# Altium project Bluetooth_Controlled_Led_Matrix_Design.PrjPcb
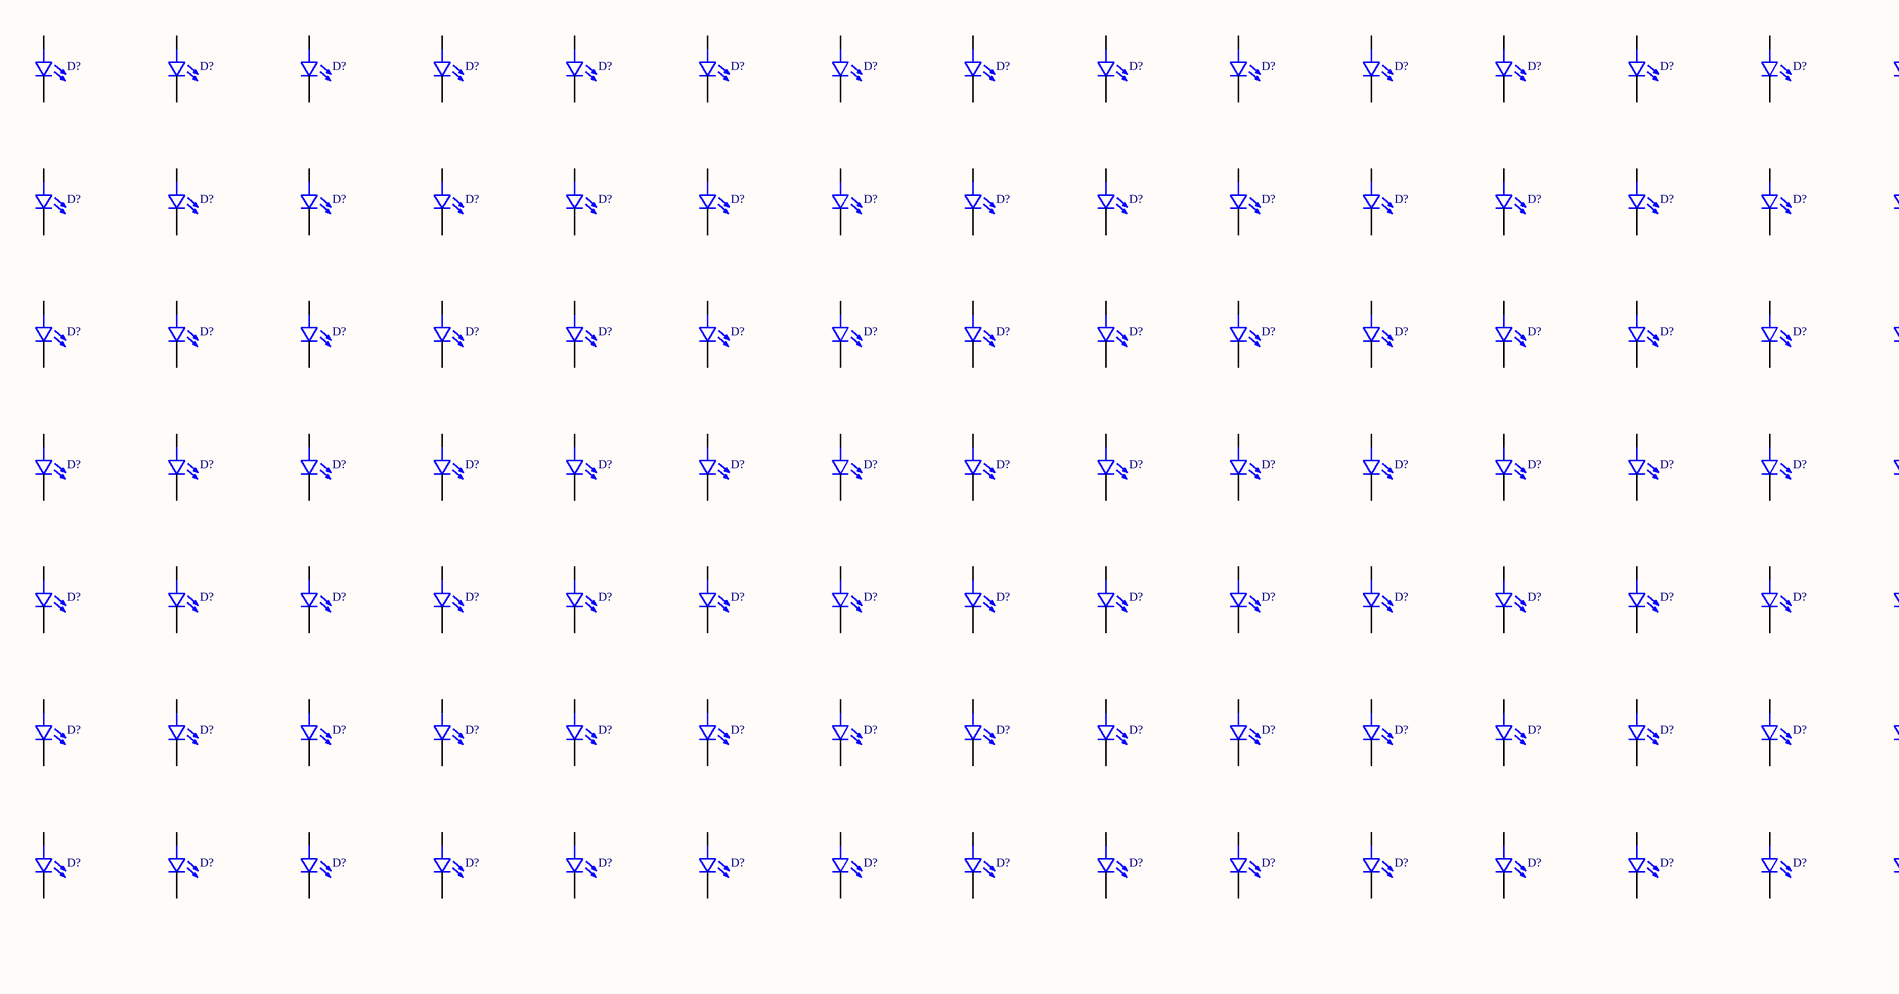
[diagram p0: 7x24_Led_Matrix.SchDoc, left]
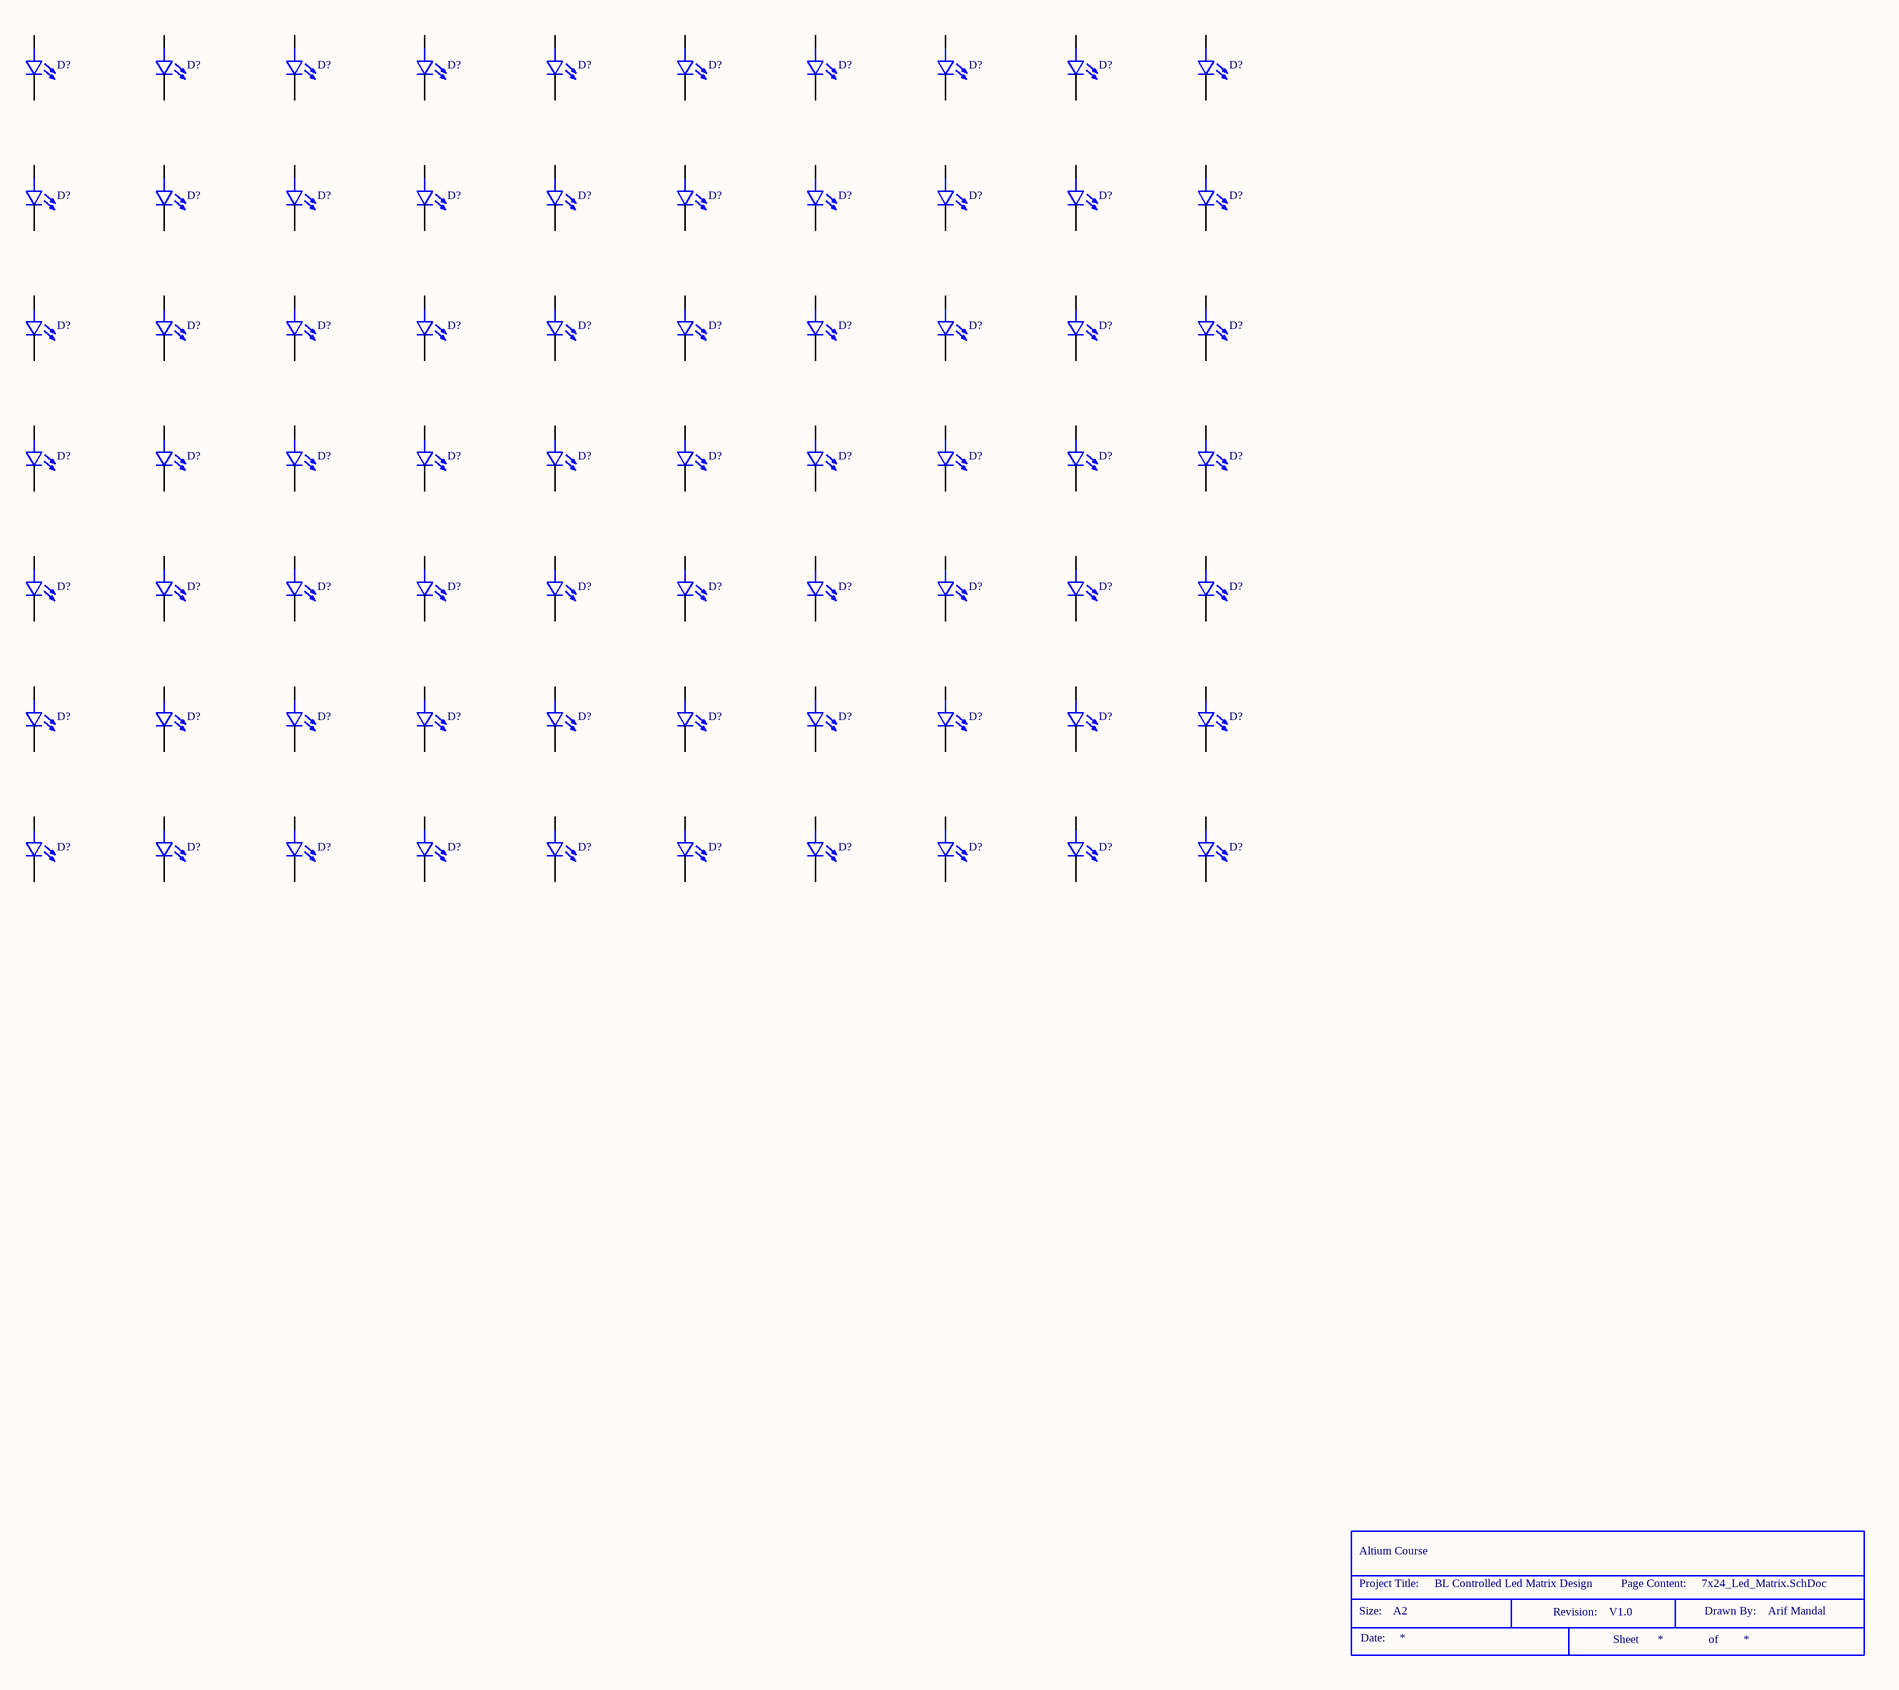
[diagram p1: 7x24_Led_Matrix.SchDoc, right]
NameProject: BL Controlled Led Matrix Design
1 sheet, 169 parts. Net scope: global (net labels, ports and power ports of the same name join across sheets).
Board file: Bluetooth_Controlled_Led_Matrix_Design.PcbDoc

## Sheet 7x24_Led_Matrix.SchDoc
size A1; Revision: V1.0

### Parts
(Parts that share a designator on the sheet are numbered #1, #2 ... from top to bottom, then left to right.)
*  Size: A2  Drawn By: Arif Mandal  (hidden comment: Title Block)  (graphical)
D?#1  SMD3528WC  [LED_OF-SMD3528WC]  (value not drawn)
D?#2  SMD3528WC  [LED_OF-SMD3528WC]  (value not drawn)
D?#3  SMD3528WC  [LED_OF-SMD3528WC]  (value not drawn)
D?#4  SMD3528WC  [LED_OF-SMD3528WC]  (value not drawn)
D?#5  SMD3528WC  [LED_OF-SMD3528WC]  (value not drawn)
D?#6  SMD3528WC  [LED_OF-SMD3528WC]  (value not drawn)
D?#7  SMD3528WC  [LED_OF-SMD3528WC]  (value not drawn)
D?#8  SMD3528WC  [LED_OF-SMD3528WC]  (value not drawn)
D?#9  SMD3528WC  [LED_OF-SMD3528WC]  (value not drawn)
D?#10  SMD3528WC  [LED_OF-SMD3528WC]  (value not drawn)
D?#11  SMD3528WC  [LED_OF-SMD3528WC]  (value not drawn)
D?#12  SMD3528WC  [LED_OF-SMD3528WC]  (value not drawn)
D?#13  SMD3528WC  [LED_OF-SMD3528WC]  (value not drawn)
D?#14  SMD3528WC  [LED_OF-SMD3528WC]  (value not drawn)
D?#15  SMD3528WC  [LED_OF-SMD3528WC]  (value not drawn)
D?#16  SMD3528WC  [LED_OF-SMD3528WC]  (value not drawn)
D?#17  SMD3528WC  [LED_OF-SMD3528WC]  (value not drawn)
D?#18  SMD3528WC  [LED_OF-SMD3528WC]  (value not drawn)
D?#19  SMD3528WC  [LED_OF-SMD3528WC]  (value not drawn)
D?#20  SMD3528WC  [LED_OF-SMD3528WC]  (value not drawn)
D?#21  SMD3528WC  [LED_OF-SMD3528WC]  (value not drawn)
D?#22  SMD3528WC  [LED_OF-SMD3528WC]  (value not drawn)
D?#23  SMD3528WC  [LED_OF-SMD3528WC]  (value not drawn)
D?#24  SMD3528WC  [LED_OF-SMD3528WC]  (value not drawn)
D?#25  SMD3528WC  [LED_OF-SMD3528WC]  (value not drawn)
D?#26  SMD3528WC  [LED_OF-SMD3528WC]  (value not drawn)
D?#27  SMD3528WC  [LED_OF-SMD3528WC]  (value not drawn)
D?#28  SMD3528WC  [LED_OF-SMD3528WC]  (value not drawn)
D?#29  SMD3528WC  [LED_OF-SMD3528WC]  (value not drawn)
D?#30  SMD3528WC  [LED_OF-SMD3528WC]  (value not drawn)
D?#31  SMD3528WC  [LED_OF-SMD3528WC]  (value not drawn)
D?#32  SMD3528WC  [LED_OF-SMD3528WC]  (value not drawn)
D?#33  SMD3528WC  [LED_OF-SMD3528WC]  (value not drawn)
D?#34  SMD3528WC  [LED_OF-SMD3528WC]  (value not drawn)
D?#35  SMD3528WC  [LED_OF-SMD3528WC]  (value not drawn)
D?#36  SMD3528WC  [LED_OF-SMD3528WC]  (value not drawn)
D?#37  SMD3528WC  [LED_OF-SMD3528WC]  (value not drawn)
D?#38  SMD3528WC  [LED_OF-SMD3528WC]  (value not drawn)
D?#39  SMD3528WC  [LED_OF-SMD3528WC]  (value not drawn)
D?#40  SMD3528WC  [LED_OF-SMD3528WC]  (value not drawn)
D?#41  SMD3528WC  [LED_OF-SMD3528WC]  (value not drawn)
D?#42  SMD3528WC  [LED_OF-SMD3528WC]  (value not drawn)
D?#43  SMD3528WC  [LED_OF-SMD3528WC]  (value not drawn)
D?#44  SMD3528WC  [LED_OF-SMD3528WC]  (value not drawn)
D?#45  SMD3528WC  [LED_OF-SMD3528WC]  (value not drawn)
D?#46  SMD3528WC  [LED_OF-SMD3528WC]  (value not drawn)
D?#47  SMD3528WC  [LED_OF-SMD3528WC]  (value not drawn)
D?#48  SMD3528WC  [LED_OF-SMD3528WC]  (value not drawn)
D?#49  SMD3528WC  [LED_OF-SMD3528WC]  (value not drawn)
D?#50  SMD3528WC  [LED_OF-SMD3528WC]  (value not drawn)
D?#51  SMD3528WC  [LED_OF-SMD3528WC]  (value not drawn)
D?#52  SMD3528WC  [LED_OF-SMD3528WC]  (value not drawn)
D?#53  SMD3528WC  [LED_OF-SMD3528WC]  (value not drawn)
D?#54  SMD3528WC  [LED_OF-SMD3528WC]  (value not drawn)
D?#55  SMD3528WC  [LED_OF-SMD3528WC]  (value not drawn)
D?#56  SMD3528WC  [LED_OF-SMD3528WC]  (value not drawn)
D?#57  SMD3528WC  [LED_OF-SMD3528WC]  (value not drawn)
D?#58  SMD3528WC  [LED_OF-SMD3528WC]  (value not drawn)
D?#59  SMD3528WC  [LED_OF-SMD3528WC]  (value not drawn)
D?#60  SMD3528WC  [LED_OF-SMD3528WC]  (value not drawn)
D?#61  SMD3528WC  [LED_OF-SMD3528WC]  (value not drawn)
D?#62  SMD3528WC  [LED_OF-SMD3528WC]  (value not drawn)
D?#63  SMD3528WC  [LED_OF-SMD3528WC]  (value not drawn)
D?#64  SMD3528WC  [LED_OF-SMD3528WC]  (value not drawn)
D?#65  SMD3528WC  [LED_OF-SMD3528WC]  (value not drawn)
D?#66  SMD3528WC  [LED_OF-SMD3528WC]  (value not drawn)
D?#67  SMD3528WC  [LED_OF-SMD3528WC]  (value not drawn)
D?#68  SMD3528WC  [LED_OF-SMD3528WC]  (value not drawn)
D?#69  SMD3528WC  [LED_OF-SMD3528WC]  (value not drawn)
D?#70  SMD3528WC  [LED_OF-SMD3528WC]  (value not drawn)
D?#71  SMD3528WC  [LED_OF-SMD3528WC]  (value not drawn)
D?#72  SMD3528WC  [LED_OF-SMD3528WC]  (value not drawn)
D?#73  SMD3528WC  [LED_OF-SMD3528WC]  (value not drawn)
D?#74  SMD3528WC  [LED_OF-SMD3528WC]  (value not drawn)
D?#75  SMD3528WC  [LED_OF-SMD3528WC]  (value not drawn)
D?#76  SMD3528WC  [LED_OF-SMD3528WC]  (value not drawn)
D?#77  SMD3528WC  [LED_OF-SMD3528WC]  (value not drawn)
D?#78  SMD3528WC  [LED_OF-SMD3528WC]  (value not drawn)
D?#79  SMD3528WC  [LED_OF-SMD3528WC]  (value not drawn)
D?#80  SMD3528WC  [LED_OF-SMD3528WC]  (value not drawn)
D?#81  SMD3528WC  [LED_OF-SMD3528WC]  (value not drawn)
D?#82  SMD3528WC  [LED_OF-SMD3528WC]  (value not drawn)
D?#83  SMD3528WC  [LED_OF-SMD3528WC]  (value not drawn)
D?#84  SMD3528WC  [LED_OF-SMD3528WC]  (value not drawn)
D?#85  SMD3528WC  [LED_OF-SMD3528WC]  (value not drawn)
D?#86  SMD3528WC  [LED_OF-SMD3528WC]  (value not drawn)
D?#87  SMD3528WC  [LED_OF-SMD3528WC]  (value not drawn)
D?#88  SMD3528WC  [LED_OF-SMD3528WC]  (value not drawn)
D?#89  SMD3528WC  [LED_OF-SMD3528WC]  (value not drawn)
D?#90  SMD3528WC  [LED_OF-SMD3528WC]  (value not drawn)
D?#91  SMD3528WC  [LED_OF-SMD3528WC]  (value not drawn)
D?#92  SMD3528WC  [LED_OF-SMD3528WC]  (value not drawn)
D?#93  SMD3528WC  [LED_OF-SMD3528WC]  (value not drawn)
D?#94  SMD3528WC  [LED_OF-SMD3528WC]  (value not drawn)
D?#95  SMD3528WC  [LED_OF-SMD3528WC]  (value not drawn)
D?#96  SMD3528WC  [LED_OF-SMD3528WC]  (value not drawn)
D?#97  SMD3528WC  [LED_OF-SMD3528WC]  (value not drawn)
D?#98  SMD3528WC  [LED_OF-SMD3528WC]  (value not drawn)
D?#99  SMD3528WC  [LED_OF-SMD3528WC]  (value not drawn)
D?#100  SMD3528WC  [LED_OF-SMD3528WC]  (value not drawn)
D?#101  SMD3528WC  [LED_OF-SMD3528WC]  (value not drawn)
D?#102  SMD3528WC  [LED_OF-SMD3528WC]  (value not drawn)
D?#103  SMD3528WC  [LED_OF-SMD3528WC]  (value not drawn)
D?#104  SMD3528WC  [LED_OF-SMD3528WC]  (value not drawn)
D?#105  SMD3528WC  [LED_OF-SMD3528WC]  (value not drawn)
D?#106  SMD3528WC  [LED_OF-SMD3528WC]  (value not drawn)
D?#107  SMD3528WC  [LED_OF-SMD3528WC]  (value not drawn)
D?#108  SMD3528WC  [LED_OF-SMD3528WC]  (value not drawn)
D?#109  SMD3528WC  [LED_OF-SMD3528WC]  (value not drawn)
D?#110  SMD3528WC  [LED_OF-SMD3528WC]  (value not drawn)
D?#111  SMD3528WC  [LED_OF-SMD3528WC]  (value not drawn)
D?#112  SMD3528WC  [LED_OF-SMD3528WC]  (value not drawn)
D?#113  SMD3528WC  [LED_OF-SMD3528WC]  (value not drawn)
D?#114  SMD3528WC  [LED_OF-SMD3528WC]  (value not drawn)
D?#115  SMD3528WC  [LED_OF-SMD3528WC]  (value not drawn)
D?#116  SMD3528WC  [LED_OF-SMD3528WC]  (value not drawn)
D?#117  SMD3528WC  [LED_OF-SMD3528WC]  (value not drawn)
D?#118  SMD3528WC  [LED_OF-SMD3528WC]  (value not drawn)
D?#119  SMD3528WC  [LED_OF-SMD3528WC]  (value not drawn)
D?#120  SMD3528WC  [LED_OF-SMD3528WC]  (value not drawn)
D?#121  SMD3528WC  [LED_OF-SMD3528WC]  (value not drawn)
D?#122  SMD3528WC  [LED_OF-SMD3528WC]  (value not drawn)
D?#123  SMD3528WC  [LED_OF-SMD3528WC]  (value not drawn)
D?#124  SMD3528WC  [LED_OF-SMD3528WC]  (value not drawn)
D?#125  SMD3528WC  [LED_OF-SMD3528WC]  (value not drawn)
D?#126  SMD3528WC  [LED_OF-SMD3528WC]  (value not drawn)
D?#127  SMD3528WC  [LED_OF-SMD3528WC]  (value not drawn)
D?#128  SMD3528WC  [LED_OF-SMD3528WC]  (value not drawn)
D?#129  SMD3528WC  [LED_OF-SMD3528WC]  (value not drawn)
D?#130  SMD3528WC  [LED_OF-SMD3528WC]  (value not drawn)
D?#131  SMD3528WC  [LED_OF-SMD3528WC]  (value not drawn)
D?#132  SMD3528WC  [LED_OF-SMD3528WC]  (value not drawn)
D?#133  SMD3528WC  [LED_OF-SMD3528WC]  (value not drawn)
D?#134  SMD3528WC  [LED_OF-SMD3528WC]  (value not drawn)
D?#135  SMD3528WC  [LED_OF-SMD3528WC]  (value not drawn)
D?#136  SMD3528WC  [LED_OF-SMD3528WC]  (value not drawn)
D?#137  SMD3528WC  [LED_OF-SMD3528WC]  (value not drawn)
D?#138  SMD3528WC  [LED_OF-SMD3528WC]  (value not drawn)
D?#139  SMD3528WC  [LED_OF-SMD3528WC]  (value not drawn)
D?#140  SMD3528WC  [LED_OF-SMD3528WC]  (value not drawn)
D?#141  SMD3528WC  [LED_OF-SMD3528WC]  (value not drawn)
D?#142  SMD3528WC  [LED_OF-SMD3528WC]  (value not drawn)
D?#143  SMD3528WC  [LED_OF-SMD3528WC]  (value not drawn)
D?#144  SMD3528WC  [LED_OF-SMD3528WC]  (value not drawn)
D?#145  SMD3528WC  [LED_OF-SMD3528WC]  (value not drawn)
D?#146  SMD3528WC  [LED_OF-SMD3528WC]  (value not drawn)
D?#147  SMD3528WC  [LED_OF-SMD3528WC]  (value not drawn)
D?#148  SMD3528WC  [LED_OF-SMD3528WC]  (value not drawn)
D?#149  SMD3528WC  [LED_OF-SMD3528WC]  (value not drawn)
D?#150  SMD3528WC  [LED_OF-SMD3528WC]  (value not drawn)
D?#151  SMD3528WC  [LED_OF-SMD3528WC]  (value not drawn)
D?#152  SMD3528WC  [LED_OF-SMD3528WC]  (value not drawn)
D?#153  SMD3528WC  [LED_OF-SMD3528WC]  (value not drawn)
D?#154  SMD3528WC  [LED_OF-SMD3528WC]  (value not drawn)
D?#155  SMD3528WC  [LED_OF-SMD3528WC]  (value not drawn)
D?#156  SMD3528WC  [LED_OF-SMD3528WC]  (value not drawn)
D?#157  SMD3528WC  [LED_OF-SMD3528WC]  (value not drawn)
D?#158  SMD3528WC  [LED_OF-SMD3528WC]  (value not drawn)
D?#159  SMD3528WC  [LED_OF-SMD3528WC]  (value not drawn)
D?#160  SMD3528WC  [LED_OF-SMD3528WC]  (value not drawn)
D?#161  SMD3528WC  [LED_OF-SMD3528WC]  (value not drawn)
D?#162  SMD3528WC  [LED_OF-SMD3528WC]  (value not drawn)
D?#163  SMD3528WC  [LED_OF-SMD3528WC]  (value not drawn)
D?#164  SMD3528WC  [LED_OF-SMD3528WC]  (value not drawn)
D?#165  SMD3528WC  [LED_OF-SMD3528WC]  (value not drawn)
D?#166  SMD3528WC  [LED_OF-SMD3528WC]  (value not drawn)
D?#167  SMD3528WC  [LED_OF-SMD3528WC]  (value not drawn)
D?#168  SMD3528WC  [LED_OF-SMD3528WC]  (value not drawn)

### Nets

Not connected (* = marked no-connect by the designer): D?#1 1(A) 2(C); D?#2 1(A) 2(C); D?#3 1(A) 2(C); D?#4 1(A) 2(C); D?#5 1(A) 2(C); D?#6 1(A) 2(C); D?#7 1(A) 2(C); D?#8 1(A) 2(C); D?#9 1(A) 2(C); D?#10 1(A) 2(C); D?#11 1(A) 2(C); D?#12 1(A) 2(C); D?#13 1(A) 2(C); D?#14 1(A) 2(C); D?#15 1(A) 2(C); D?#16 1(A) 2(C); D?#17 1(A) 2(C); D?#18 1(A) 2(C); D?#19 1(A) 2(C); D?#20 1(A) 2(C); D?#21 1(A) 2(C); D?#22 1(A) 2(C); D?#23 1(A) 2(C); D?#24 1(A) 2(C); D?#25 1(A) 2(C); D?#26 1(A) 2(C); D?#27 1(A) 2(C); D?#28 1(A) 2(C); D?#29 1(A) 2(C); D?#30 1(A) 2(C); D?#31 1(A) 2(C); D?#32 1(A) 2(C); D?#33 1(A) 2(C); D?#34 1(A) 2(C); D?#35 1(A) 2(C); D?#36 1(A) 2(C); D?#37 1(A) 2(C); D?#38 1(A) 2(C); D?#39 1(A) 2(C); D?#40 1(A) 2(C); D?#41 1(A) 2(C); D?#42 1(A) 2(C); D?#43 1(A) 2(C); D?#44 1(A) 2(C); D?#45 1(A) 2(C); D?#46 1(A) 2(C); D?#47 1(A) 2(C); D?#48 1(A) 2(C); D?#49 1(A) 2(C); D?#50 1(A) 2(C); D?#51 1(A) 2(C); D?#52 1(A) 2(C); D?#53 1(A) 2(C); D?#54 1(A) 2(C); D?#55 1(A) 2(C); D?#56 1(A) 2(C); D?#57 1(A) 2(C); D?#58 1(A) 2(C); D?#59 1(A) 2(C); D?#60 1(A) 2(C); D?#61 1(A) 2(C); D?#62 1(A) 2(C); D?#63 1(A) 2(C); D?#64 1(A) 2(C); D?#65 1(A) 2(C); D?#66 1(A) 2(C); D?#67 1(A) 2(C); D?#68 1(A) 2(C); D?#69 1(A) 2(C); D?#70 1(A) 2(C); D?#71 1(A) 2(C); D?#72 1(A) 2(C); D?#73 1(A) 2(C); D?#74 1(A) 2(C); D?#75 1(A) 2(C); D?#76 1(A) 2(C); D?#77 1(A) 2(C); D?#78 1(A) 2(C); D?#79 1(A) 2(C); D?#80 1(A) 2(C); D?#81 1(A) 2(C); D?#82 1(A) 2(C); D?#83 1(A) 2(C); D?#84 1(A) 2(C); D?#85 1(A) 2(C); D?#86 1(A) 2(C); D?#87 1(A) 2(C); D?#88 1(A) 2(C); D?#89 1(A) 2(C); D?#90 1(A) 2(C); D?#91 1(A) 2(C); D?#92 1(A) 2(C); D?#93 1(A) 2(C); D?#94 1(A) 2(C); D?#95 1(A) 2(C); D?#96 1(A) 2(C); D?#97 1(A) 2(C); D?#98 1(A) 2(C); D?#99 1(A) 2(C); D?#100 1(A) 2(C); D?#101 1(A) 2(C); D?#102 1(A) 2(C); D?#103 1(A) 2(C); D?#104 1(A) 2(C); D?#105 1(A) 2(C); D?#106 1(A) 2(C); D?#107 1(A) 2(C); D?#108 1(A) 2(C); D?#109 1(A) 2(C); D?#110 1(A) 2(C); D?#111 1(A) 2(C); D?#112 1(A) 2(C); D?#113 1(A) 2(C); D?#114 1(A) 2(C); D?#115 1(A) 2(C); D?#116 1(A) 2(C); D?#117 1(A) 2(C); D?#118 1(A) 2(C); D?#119 1(A) 2(C); D?#120 1(A) 2(C); D?#121 1(A) 2(C); D?#122 1(A) 2(C); D?#123 1(A) 2(C); D?#124 1(A) 2(C); D?#125 1(A) 2(C); D?#126 1(A) 2(C); D?#127 1(A) 2(C); D?#128 1(A) 2(C); D?#129 1(A) 2(C); D?#130 1(A) 2(C); D?#131 1(A) 2(C); D?#132 1(A) 2(C); D?#133 1(A) 2(C); D?#134 1(A) 2(C); D?#135 1(A) 2(C); D?#136 1(A) 2(C); D?#137 1(A) 2(C); D?#138 1(A) 2(C); D?#139 1(A) 2(C); D?#140 1(A) 2(C); D?#141 1(A) 2(C); D?#142 1(A) 2(C); D?#143 1(A) 2(C); D?#144 1(A) 2(C); D?#145 1(A) 2(C); D?#146 1(A) 2(C); D?#147 1(A) 2(C); D?#148 1(A) 2(C); D?#149 1(A) 2(C); D?#150 1(A) 2(C); D?#151 1(A) 2(C); D?#152 1(A) 2(C); D?#153 1(A) 2(C); D?#154 1(A) 2(C); D?#155 1(A) 2(C); D?#156 1(A) 2(C); D?#157 1(A) 2(C); D?#158 1(A) 2(C); D?#159 1(A) 2(C); D?#160 1(A) 2(C); D?#161 1(A) 2(C); D?#162 1(A) 2(C); D?#163 1(A) 2(C); D?#164 1(A) 2(C); D?#165 1(A) 2(C); D?#166 1(A) 2(C); D?#167 1(A) 2(C); D?#168 1(A) 2(C)

### Notes on the sheet
- (in symbol Title Block) Altium Course; Project Title:; Page Content:; Size:; Revision:; Drawn By:; Date:; Sheet; of

### Library data of the parts
D?#1-D?#168 = SMD3528WC: LED; SMD; 3528, PLCC2; white cold; 1700-2500mcd; 120Â°; 2; MP: OF-SMD3528WC; MF: Optoflash; Availability: Not in stock; SnapEDA_Link: https://www.snapeda.com/parts/OF-SMD3528WC/Optoflash/view-part/?ref=snap; Value: *; Price: None; Package: PLCC-2 Optoflash; Check_prices: https://www.snapeda.com/parts/OF-SMD3528WC/Optoflash/view-part/?ref=eda